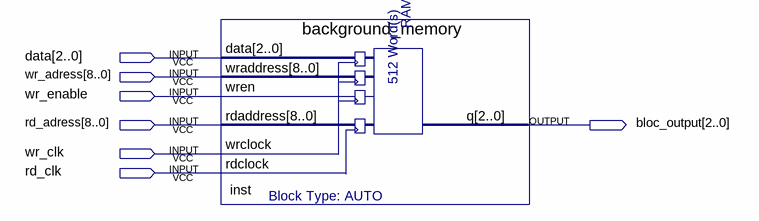
[diagram p0: schematic sheet]
// Quartus schematic background_memory_component.bdf as structural Verilog: 1 symbols, 7 pins
module background_memory_component (
  input  [2:0] data,
  input  [8:0] wr_adress,
  input  wr_enable,
  input  [8:0] rd_adress,
  input  wr_clk,
  input  rd_clk,
  output [2:0] bloc_output
);

  background_memory inst (
    .data(data), .wraddress(wr_adress), .wren(wr_enable), .rdaddress(rd_adress), .wrclock(wr_clk),
    .rdclock(rd_clk), .q(bloc_output));
endmodule
